# Altium project guitarDSP.PrjPcb
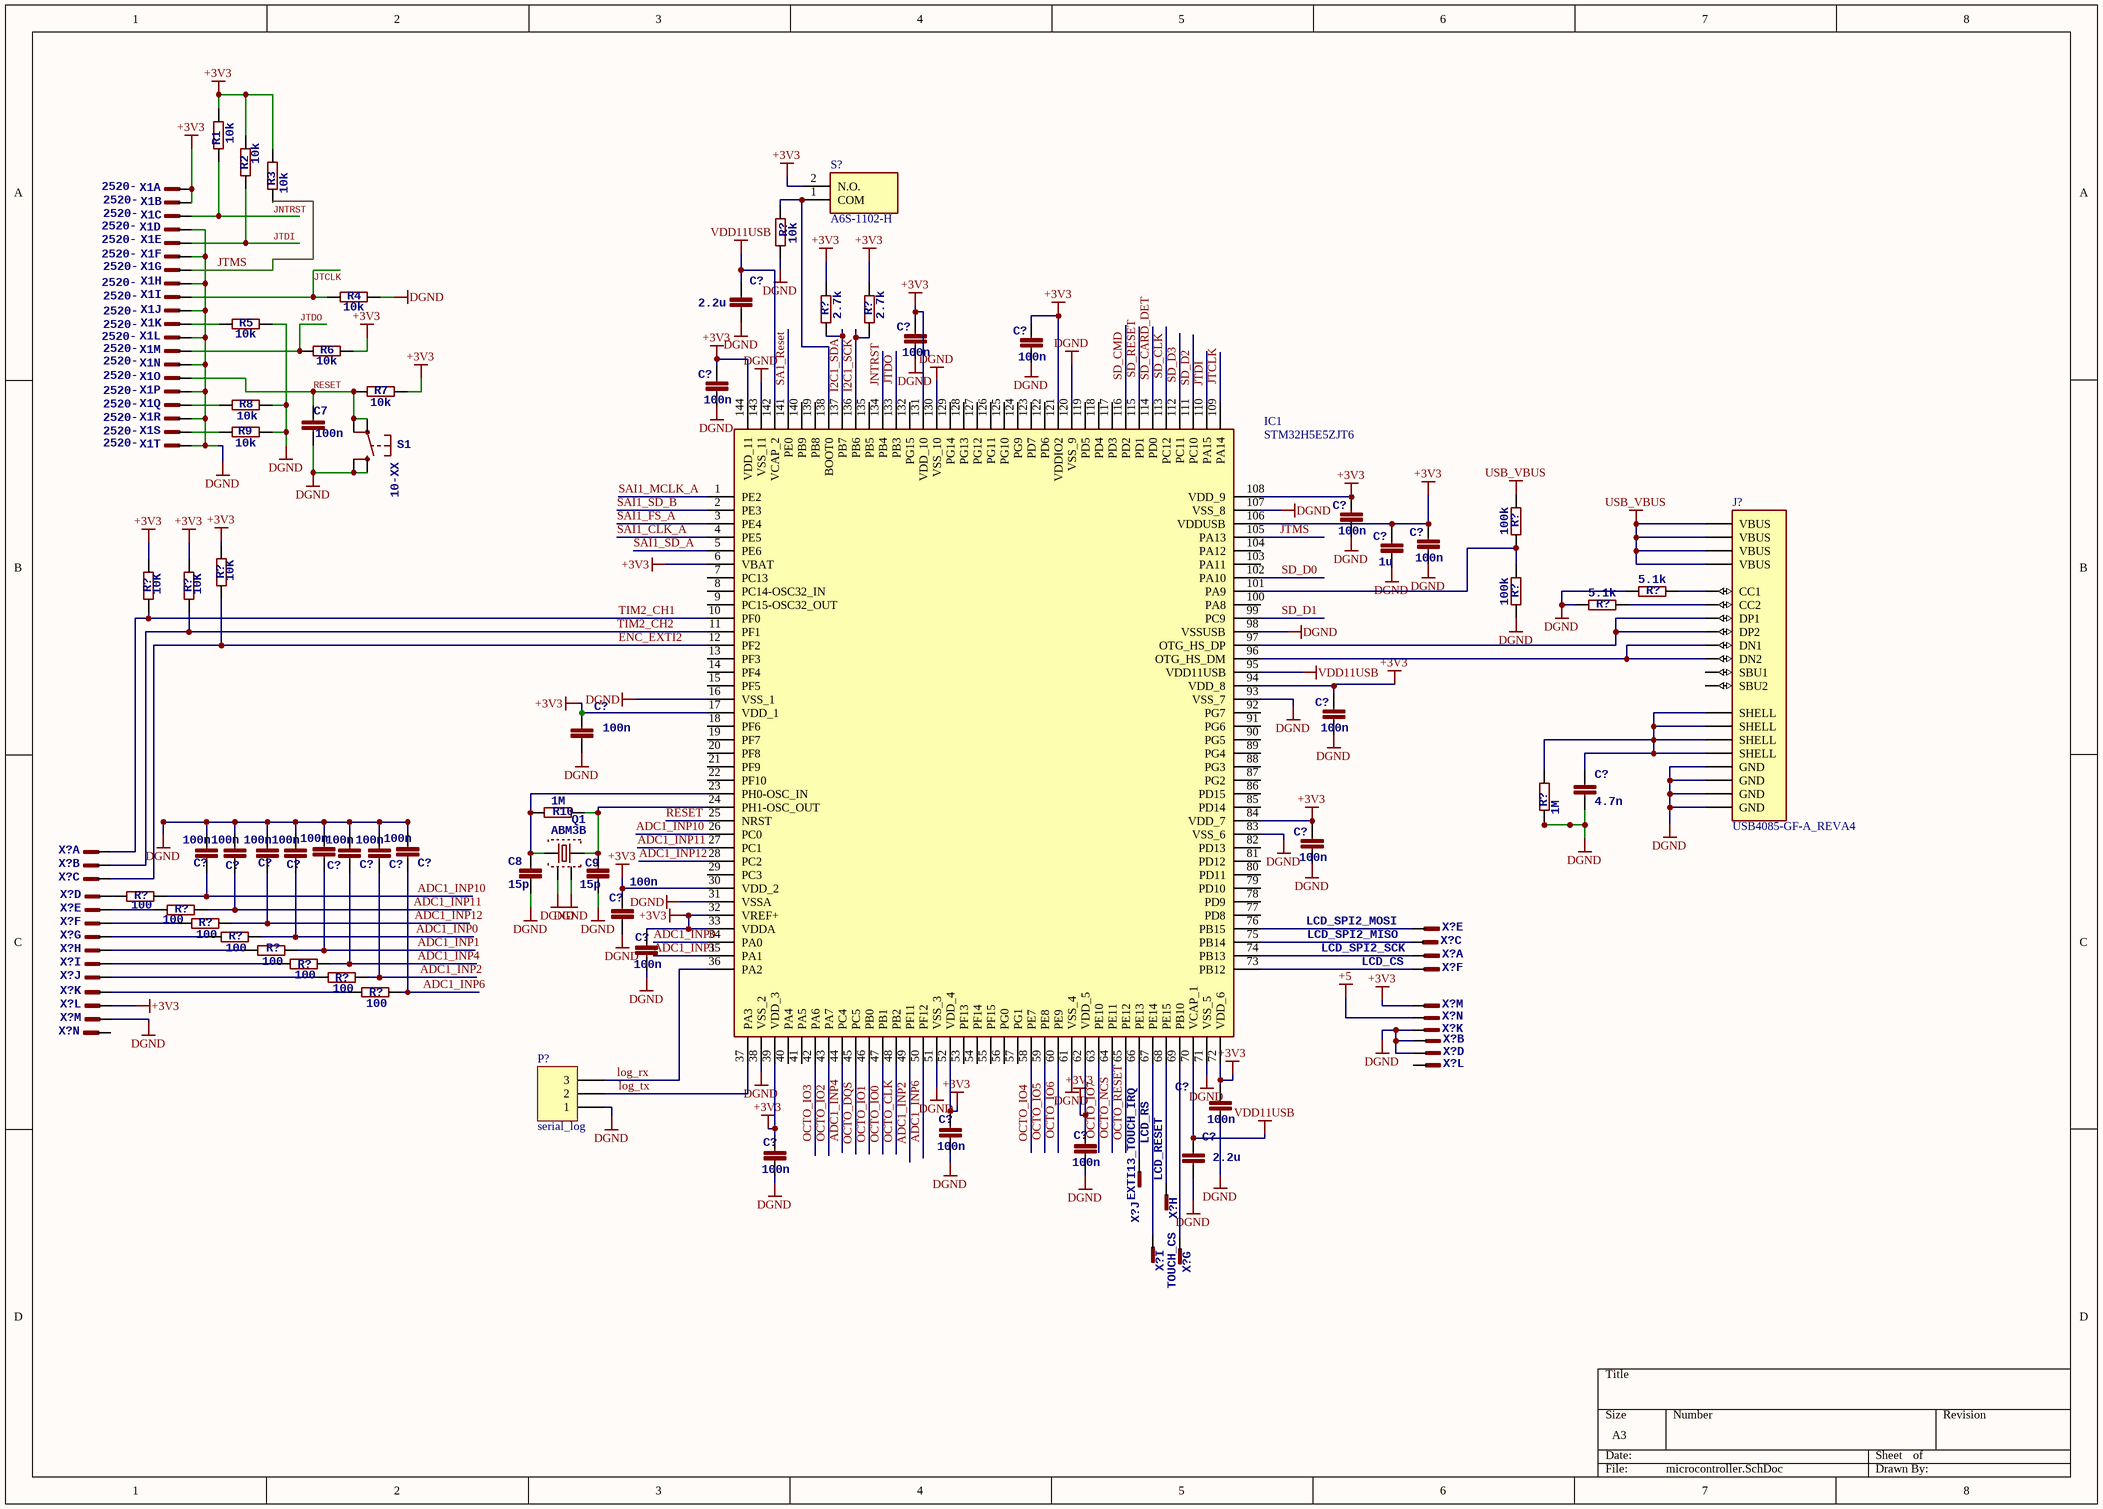
[diagram p0: microcontroller.SchDoc]
4 sheets, 138 parts. Net scope: global (net labels, ports and power ports of the same name join across sheets).
Board file: dsp.PcbDoc
Sheets:
  microcontroller.SchDoc
  memory.SchDoc
  audio.SchDoc
  bluetooth.SchDoc

## Sheet microcontroller.SchDoc
size A3; SheetNumber: 1; SheetTotal: 4

### Parts
(Parts that share a designator on the sheet are numbered #1, #2 ... from top to bottom, then left to right.)
C7  100n  [C0402]
C8  15p  [C0402]
C9  15p  [C0402]
C?#1  2.2u  [C0805]
C?#2  100n  [C0402]
C?#3  100n  [C0402]
C?#4  100n  [C0402]
C?#5  100n  [C0402]
C?#6  1u  [C0402]
C?#7  100n  [C0402]
C?#8  100n  [C0402]
C?#9  100n  [C0402]
C?#10  4.7n  [C0805]
C?#11  100n  [C0402]
C?#12  100n  [C0402]
C?#13  100n  [C0402]
C?#14  100n  [C0402]
C?#15  100n  [C0402]
C?#16  100n  [C0402]
C?#17  100n  [C0402]
C?#18  100n  [C0402]
C?#19  100n  [C0402]
C?#20  100n  [C0402]
C?#21  100n  [C0402]
C?#22  100n  [C0402]
C?#23  100n  [C0402]
C?#24  100n  [C0402]
C?#25  100n  [C0402]
C?#26  2.2u  [C0805]
IC1  STM32H5E5ZJT6  [QFP50P2200X2200X160-144N]
J?  USB4085-GF-A_REVA4  [GCT_USB4085-GF-A_REVA4]
P?#1  serial_log  [HDR1X3]
Q1  ABM3B  [ABM3B]
R1  10k  [R0805]
R2  10k  [R0805]
R3  10k  [R0805]
R4  10k  [R0805]
R5  10k  [R0805]
R6  10k  [R0805]
R7  10k  [R0805]
R8  10k  [R0805]
R9  10k  [R0805]
R10  1M  [R0402]
R?#1  10k  [R0805]
R?#2  2.7k  [R0805]
R?#3  2.7k  [R0805]
R?#4  100k  [R0805]
R?#5  10K  [R0805]
R?#6  10K  [R0805]
R?#7  10K  [R0805]
R?#8  100k  [R0805]
R?#9  5.1k  [R0805]
R?#10  5.1k  [R0805]
R?#11  1M  [R0805]
R?#12  100  [R0805]
R?#13  100  [R0805]
R?#14  100  [R0805]
R?#15  100  [R0805]
R?#16  100  [R0805]
R?#17  100  [R0805]
R?#18  100  [R0805]
R?#19  100  [R0805]
S1  10-XX  [B3F-10XX]
S?  A6S-1102-H  [A6S1102H]
X1  2520-  [PAK100/2500-20]  (parts A,B,C,D,E,F,G,H,I,J,K,L,M,N,O,P,Q,R,S,T of 20)
X?#1  (no value)  [PAK100/2500-14]  (part A of 14)
X?#2  (no value)  [PAK100/2500-14]  (part B of 14)
X?#3  (no value)  [PAK100/2500-14]  (part C of 14)
X?#4  (no value)  [PAK100/2500-14]  (part D of 14)
X?#5  (no value)  [PAK100/2500-14]  (part E of 14)
X?#6  (no value)  [PAK100/2500-14]  (part F of 14)
X?#7  LCD_SPI2_MOSI  [PAK100/2500-14]  (part E of 14)
X?#8  (no value)  [PAK100/2500-14]  (part G of 14)
X?#9  LCD_SPI2_MISO  [PAK100/2500-14]  (part C of 14)
X?#10  (no value)  [PAK100/2500-14]  (part H of 14)
X?#11  LCD_SPI2_SCK  [PAK100/2500-14]  (part A of 14)
X?#12  (no value)  [PAK100/2500-14]  (part I of 14)
X?#13  LCD_CS  [PAK100/2500-14]  (part F of 14)
X?#14  (no value)  [PAK100/2500-14]  (part J of 14)
X?#15  (no value)  [PAK100/2500-14]  (part K of 14)
X?#16  (no value)  [PAK100/2500-14]  (part L of 14)
X?#17  LCD_CS  [PAK100/2500-14]  (value not drawn)  (part M of 14)
X?#18  (no value)  [PAK100/2500-14]  (part M of 14)
X?#19  LCD_CS  [PAK100/2500-14]  (value not drawn)  (part N of 14)
X?#20  (no value)  [PAK100/2500-14]  (part N of 14)
X?#21  (no value)  [PAK100/2500-14]  (part K of 14)
X?#22  (no value)  [PAK100/2500-14]  (part B of 14)
X?#23  (no value)  [PAK100/2500-14]  (part D of 14)
X?#24  LCD_CS  [PAK100/2500-14]  (value not drawn)  (part L of 14)
X?#25  EXTI13_TOUCH_IRQ  [PAK100/2500-14]  (part J of 14)
X?#26  LCD_RESET  [PAK100/2500-14]  (part H of 14)
X?#27  LCD_RS  [PAK100/2500-14]  (part I of 14)
X?#28  TOUCH_CS  [PAK100/2500-14]  (part G of 14)

### Nets
+3V3: C?#2.1 C?#3.1 C?#4.1 C?#5.1 C?#6.1 C?#7.1 C?#8.1 C?#9.1 C?#11.1 C?#20.1 C?#21.1 C?#22.1 C?#23.1 C?#24.1 C?#25.1 IC1.6(VBAT) IC1.17(VDD_1) IC1.30(VDD_2) IC1.32(VREF+) IC1.33(VDDA) IC1.39(VDD_3) IC1.52(VDD_4) IC1.62(VDD_5) IC1.72(VDD_6) IC1.84(VDD_7) IC1.94(VDD_8) IC1.106(VDDUSB) IC1.108(VDD_9) IC1.121(VDDIO2) IC1.131(VDD_10) IC1.144(VDD_11) R1.2 R2.2 R3.2 R6.1 R7.1 R?#2.1 R?#3.1 R?#5.1 R?#6.1 R?#7.1 S?.2(N.O.) X1.1(KL) X1.2(KL) X?#16.12(KL) X?#17.13(KL)
+5: X?#19.14(KL)
DGND: C7.2 C8.2 C9.2 C?#1.2 C?#2.2 C?#3.2 C?#4.2 C?#5.2 C?#6.2 C?#7.2 C?#8.2 C?#9.2 C?#10.2 C?#11.2 C?#12.1 C?#13.1 C?#14.1 C?#15.1 C?#16.1 C?#17.1 C?#18.1 C?#19.1 C?#20.2 C?#21.2 C?#22.2 C?#23.2 C?#24.2 C?#25.2 C?#26.2 IC1.16(VSS_1) IC1.31(VSSA) IC1.38(VSS_2) IC1.51(VSS_3) IC1.61(VSS_4) IC1.71(VSS_5) IC1.83(VSS_6) IC1.93(VSS_7) IC1.98(VSSUSB) IC1.107(VSS_8) IC1.120(VSS_9) IC1.130(VSS_10) IC1.143(VSS_11) J?.A1(GND) J?.A12(GND) J?.B1(GND) J?.B12(GND) P?#1.1 Q1.P$2 Q1.P$4 R4.1 R5.1 R8.1 R9.1 R?#1.2 R?#8.2 R?#9.2 R?#10.2 R?#11.1 S1.1(S) S1.2(S1) X1.4(KL) X1.6(KL) X1.8(KL) X1.10(KL) X1.12(KL) X1.14(KL) X1.16(KL) X1.18(KL) X1.20(KL) X?#18.13(KL) X?#21.11(KL) X?#22.2(KL) X?#23.4(KL)
USB_VBUS: J?.A4(VBUS) J?.A9(VBUS) J?.B4(VBUS) J?.B9(VBUS) R?#4.1
VDD11USB: C?#1.1 C?#26.1 IC1.70(VCAP_1) IC1.95(VDD11USB) IC1.142(VCAP_2)
ADC1_INP0: C?#17.2 IC1.34(PA0) R?#15.1
ADC1_INP1: C?#12.2 IC1.35(PA1) R?#16.1
ADC1_INP2: C?#19.2 IC1.49(PF11) R?#18.1
ADC1_INP4: C?#18.2 IC1.44(PC4) R?#17.1
ADC1_INP6: C?#13.2 IC1.50(PF12) R?#19.1
ADC1_INP10: C?#14.2 IC1.26(PC0) R?#12.1
ADC1_INP11: C?#15.2 IC1.27(PC1) R?#13.1
ADC1_INP12: C?#16.2 IC1.28(PC2) R?#14.1
ENC_EXTI2: IC1.12(PF2) R?#5.2 X?#3.3(KL)
I2C1_SCK: IC1.136(PB6) R?#3.2
I2C1_SDA: IC1.137(PB7) R?#2.2
JNTRST: IC1.134(PB4) R1.1 X1.3(KL)
JTCLK: IC1.109(PA14) R4.2 X1.9(KL)
JTDI: IC1.110(PA15) R2.1 X1.5(KL)
JTDO: IC1.133(PB3) R6.2 X1.13(KL)
JTMS: IC1.105(PA13) R3.1 X1.7(KL)
log_rx: IC1.36(PA2) P?#1.3
log_tx: IC1.37(PA3) P?#1.2
OCTO_CLK: IC1.48(PB2)
OCTO_DQS: IC1.45(PC5)
OCTO_IO0: IC1.47(PB1)
OCTO_IO1: IC1.46(PB0)
OCTO_IO2: IC1.43(PA7)
OCTO_IO3: IC1.42(PA6)
OCTO_IO4: IC1.58(PE7)
OCTO_IO5: IC1.59(PE8)
OCTO_IO6: IC1.60(PE9)
OCTO_IO7: IC1.63(PE10)
OCTO_NCS: IC1.64(PE11)
OCTO_RESET: IC1.65(PE12)
RESET: C7.1 IC1.25(NRST) R7.2 S1.3(P) S1.4(P1) X1.15(KL)
SA1_Reset: IC1.141(PE0)
SAI1_CLK_A: IC1.4(PE5)
SAI1_FS_A: IC1.3(PE4)
SAI1_MCLK_A: IC1.1(PE2)
SAI1_SD_A: IC1.5(PE6)
SAI1_SD_B: IC1.2(PE3)
SD_CARD_DET: IC1.114(PD0)
SD_CLK: IC1.113(PC12)
SD_CMD: IC1.116(PD2)
SD_D0: IC1.102(PA10)
SD_D1: IC1.99(PC9)
SD_D2: IC1.111(PC10)
SD_D3: IC1.112(PC11)
SD_RESET: IC1.115(PD1)
TIM2_CH1: IC1.10(PF0) R?#6.2 X?#1.1(KL)
TIM2_CH2: IC1.11(PF1) R?#7.2 X?#2.2(KL)
NetC8_1: C8.1 IC1.23(PH0-OSC_IN) Q1.P$1 R10.2
NetC9_1: C9.1 IC1.24(PH1-OSC_OUT) Q1.P$3 R10.1
NetC?#10_1: C?#10.1 J?.S1(SHELL) J?.S2(SHELL) J?.S3(SHELL) J?.S4(SHELL) R?#11.2
NetIC1_66: IC1.66(PE13) X?#25.10(KL)
NetIC1_67: IC1.67(PE14) X?#27.9(KL)
NetIC1_68: IC1.68(PE15) X?#26.8(KL)
NetIC1_69: IC1.69(PB10) X?#28.7(KL)
NetIC1_73: IC1.73(PB12) X?#13.6(KL)
NetIC1_74: IC1.74(PB13) X?#11.1(KL)
NetIC1_75: IC1.75(PB14) X?#9.3(KL)
NetIC1_76: IC1.76(PB15) X?#7.5(KL)
NetIC1_96: IC1.96(OTG_HS_DM) J?.A7(DN1) J?.B7(DN2)
NetIC1_97: IC1.97(OTG_HS_DP) J?.A6(DP1) J?.B6(DP2)
NetIC1_101: IC1.101(PA9) R?#4.2 R?#8.1
NetIC1_138: IC1.138(BOOT0) R?#1.1 S?.1(COM)
NetJ?_A5: J?.A5(CC1) R?#9.1
NetJ?_B5: J?.B5(CC2) R?#10.1
NetR5_2: R5.2 X1.11(KL)
NetR8_2: R8.2 X1.17(KL)
NetR9_2: R9.2 X1.19(KL)
NetR?#12_2: R?#12.2 X?#4.4(KL)
NetR?#13_2: R?#13.2 X?#5.5(KL)
NetR?#14_2: R?#14.2 X?#6.6(KL)
NetR?#15_2: R?#15.2 X?#8.7(KL)
NetR?#16_2: R?#16.2 X?#10.8(KL)
NetR?#17_2: R?#17.2 X?#12.9(KL)
NetR?#18_2: R?#18.2 X?#14.10(KL)
NetR?#19_2: R?#19.2 X?#15.11(KL)

Not connected (* = marked no-connect by the designer): IC1 7(PC13) 8(PC14-OSC32_IN) 9(PC15-OSC32_OUT) 13(PF3) 14(PF4) 15(PF5) 18(PF6) 19(PF7) 20(PF8) 21(PF9) 22(PF10) 29(PC3) 40(PA4) 41(PA5) 53(PF13) 54(PF14) 55(PF15) 56(PG0) 57(PG1) 77(PD8) 78(PD9) 79(PD10) 80(PD11) 81(PD12) 82(PD13) 85(PD14) 86(PD15) 87(PG2) 88(PG3) 89(PG4) 90(PG5) 91(PG6) 92(PG7) 100(PA8) 103(PA11) 104(PA12) 117(PD3) 118(PD4) 119(PD5) 122(PD6) 123(PD7) 124(PG9) 125(PG10) 126(PG11) 127(PG12) 128(PG13) 129(PG14) 132(PG15) 135(PB5) 139(PB8) 140(PB9); J? A8(SBU1) B8(SBU2); X?#20 14(KL); X?#24 12(KL)

### Library data of the parts
C7-C9 C?#1-C?#9 C?#11-C?#26 = C-EUC0402: <B>CAPACITOR</B>, European symbol; SPICEPREFIX: C
C?#10 = C-EUC0805: <B>CAPACITOR</B>, European symbol; SPICEPREFIX: C
IC1 = STM32H5E5ZJT6: Integrated Circuit; Manufacturer_Name: STMicroelectronics; Datasheet Link: https://www.st.com/resource/en/datasheet/stm32h5e4vj.pdf; Height: 1.6mm; Manufacturer_Part_Number: STM32H5E5ZJT6; Arrow Part Number: STM32H5E5ZJT6; Arrow Price/Stock: https://www.arrow.com/en/products/stm32h5e5zjt6/stmicroelectronics.html?utm_currency=USD&region=nac
J? = USB4085-GF-A_REVA4: USB-C (USB TYPE-C) USB 2.0 Receptacle Connector 24 (16+8 Dummy) Position Through Hole, Right Angle, low cost, 3.46mm profile, 16 pin, horizontal, Top mount; MF: Global Connector Technology; SnapEDA_Link: https://www.snapeda.com/parts/USB4085-GF-A/Global+Connector+Technology/view-part/?ref=snap; Package: None; MP: USB4085-GF-A; Check_prices: https://www.snapeda.com/parts/USB4085-GF-A/Global+Connector+Technology/view-part/?ref=eda; Purchase-URL: https://pricing.snapeda.com/search/part/USB4085-GF-A/?ref=eda; Price: None; Value: *; Availability: In Stock
P?#1 = Header 3: Header, 3-Pin; LatestRevisionDate: 17-Jul-2002; LatestRevisionNote: Re-released for DXP Platform.; Publisher: Altium Limited
R1-R9 R?#1-R?#19 = R-EU_R0805: <B>RESISTOR</B>, European symbol
R10 = R-EU_R0402: <B>RESISTOR</B>, European symbol
S1 = 10-XX: <b>OMRON SWITCH</b>; MPN: B3F-1000; OC_FARNELL: 176432; OC_NEWARK: 36M3542
S? = A6S-1102-H: Switch; Manufacturer_Name: OMRON Electronics; Datasheet Link: https://components.omron.com/us-en/sites/components.omron.com.us/files/datasheet_pdf/A211-E1.pdf; Height: 3.8mm; Manufacturer_Part_Number: A6S-1102-H; Mouser Part Number: 653-A6S-1102-H; Mouser Price/Stock: https://www.mouser.co.uk/ProductDetail/Omron-Electronics/A6S-1102-H?qs=FFtkVBg2Ai6emF35RthuRw%3D%3D; Arrow Part Number: A6S-1102-H; Arrow Price/Stock: https://www.arrow.com/en/products/a6s1102h/omron?region=nac
X1 = 2520-: <b>3M (TM) Pak 100 4-Wall Header</b><p> / Source: 3M; OC_FARNELL: unknown; OC_NEWARK: unknown
X?#1-X?#28 = 2514-: OC_FARNELL: unknown; OC_NEWARK: unknown

## Sheet memory.SchDoc
size A4; SheetNumber: 2; SheetTotal: 4
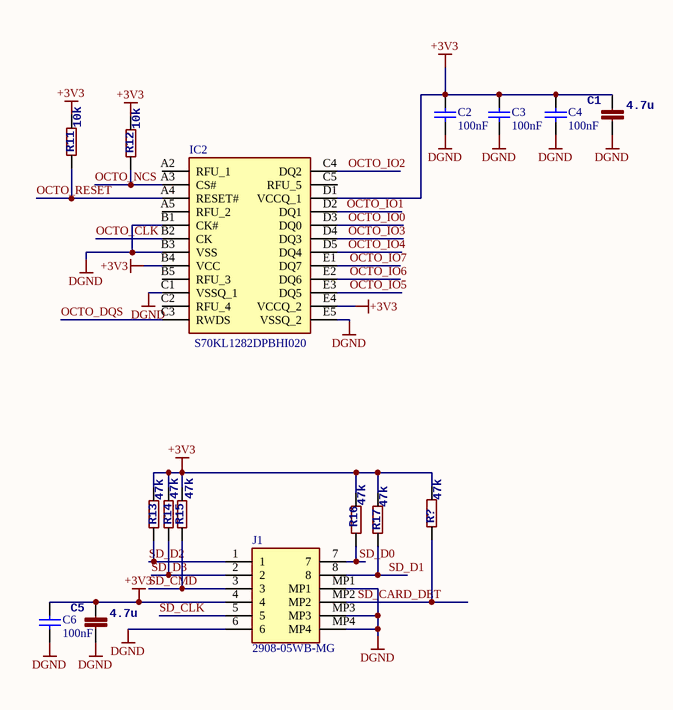
[diagram p1: memory.SchDoc]

### Parts
(Parts that share a designator on the sheet are numbered #1, #2 ... from top to bottom, then left to right.)
C1  4.7u  [C0805]
C2  value 100nF  [C0402]  (hidden comment: Capacitor)
C3  value 100nF  [C0402]  (hidden comment: Capacitor)
C4  value 100nF  [C0402]  (hidden comment: Capacitor)
C5  4.7u  [C0805]
C6  value 100nF  [C0402]  (hidden comment: Capacitor)
IC2  S70KL1282DPBHI020  [BGA24C100P5X5_600X800X100]
J1  2908-05WB-MG  [290805WBMG]
R11  10k  [R0805]
R12  10k  [R0805]
R13  47k  [R0805]
R14  47k  [R0805]
R15  47k  [R0805]
R16  47k  [R0805]
R17  47k  [R0805]
R?#20  47k  [R0805]

### Nets
+3V3: C1.1 C2.2 C3.2 C4.2 C5.1 C6.2 IC2.B4(VCC) IC2.D1(VCCQ_1) IC2.E4(VCCQ_2) J1.4 R11.2 R12.2 R13.2 R14.2 R15.2 R16.2 R17.2 R?#20.2
DGND: C1.2 C2.1 C3.1 C4.1 C5.2 C6.1 IC2.B1(CK#) IC2.B3(VSS) IC2.C1(VSSQ_1) IC2.E5(VSSQ_2) J1.6 J1.MP1 J1.MP3 J1.MP4
OCTO_CLK: IC2.B2(CK)
OCTO_DQS: IC2.C3(RWDS)
OCTO_IO0: IC2.D3(DQ0)
OCTO_IO1: IC2.D2(DQ1)
OCTO_IO2: IC2.C4(DQ2)
OCTO_IO3: IC2.D4(DQ3)
OCTO_IO4: IC2.D5(DQ4)
OCTO_IO5: IC2.E3(DQ5)
OCTO_IO6: IC2.E2(DQ6)
OCTO_IO7: IC2.E1(DQ7)
OCTO_NCS: IC2.A3(CS#) R12.1
OCTO_RESET: IC2.A4(RESET#) R11.1
SD_CARD_DET: J1.MP2 R?#20.1
SD_CLK: J1.5
SD_CMD: J1.3 R15.1
SD_D0: J1.7 R16.1
SD_D1: J1.8 R17.1
SD_D2: J1.1 R13.1
SD_D3: J1.2 R14.1

Not connected (* = marked no-connect by the designer): IC2 A2(RFU_1) A5(RFU_2) B5(RFU_3) C2(RFU_4) C5(RFU_5)

### Library data of the parts
C1 C5 = C-EUC0805: SPICEPREFIX: C
C2-C4 C6 = MCD-00102: Capacitor, MLCC, 100nF, 16V, X7R, 10%, 0402, T=0,5mm; Manufacturer_Part_Number: CC0402KRX7R7BB104; Manufacturer: YAGEO; Alternate_Manufacturer_Part_Number: GCM155R71C104KA55D; Alternate_Manufacturer: MURATA; ECCN_US: EAR99; ECCN_EU: NEC; Provided_By: SUBCO; Internal_Part_Number: MCD-00102; Status: Released; Part_Type: Capacitor; Package: C0402; ComponentLink1Description: Datasheet; ComponentLink1URL: http://tunmcdsvn.tun.st.com/Component_Datasheet_Library/Trunk/Capacitors/Yageo_Multilayer_Capacitor_X7R_series_100pF_to_22uF
IC2 = S70KL1282DPBHI020: Integrated Circuit; Manufacturer_Name: Infineon; Datasheet Link: https://www.cypress.com/file/501841/download; Height: 1mm; Manufacturer_Part_Number: S70KL1282DPBHI020; Mouser Part Number: 727-70KL1282DPBHI020; Mouser Price/Stock: https://www.mouser.co.uk/ProductDetail/Infineon-Technologies/S70KL1282DPBHI020?qs=DPoM0jnrROVgAEZ0o2TpIw%3D%3D
J1 = 2908-05WB-MG: Connector; Manufacturer_Name: 3M; Datasheet Link: https://componentsearchengine.com/Datasheets/1/2908-05WB-MG.pdf; Height: 1.85mm; Manufacturer_Part_Number: 2908-05WB-MG; Mouser Part Number: 517-2908-05WB-MG; Mouser Price/Stock: https://www.mouser.co.uk/ProductDetail/3M-Electronic-Solutions-Division/2908-05WB-MG?qs=vnwGVgFuQiZPJoOt79ALlw%3D%3D; Arrow Part Number: 2908-05WB-MG; Arrow Price/Stock: https://www.arrow.com/en/products/2908-05wb-mg/3m.html?utm_currency=USD&region=europe
R11-R17 R?#20 = R-EU_R0805: <B>RESISTOR</B>, European symbol

## Sheet audio.SchDoc
size A4; SheetNumber: 3; SheetTotal: 4
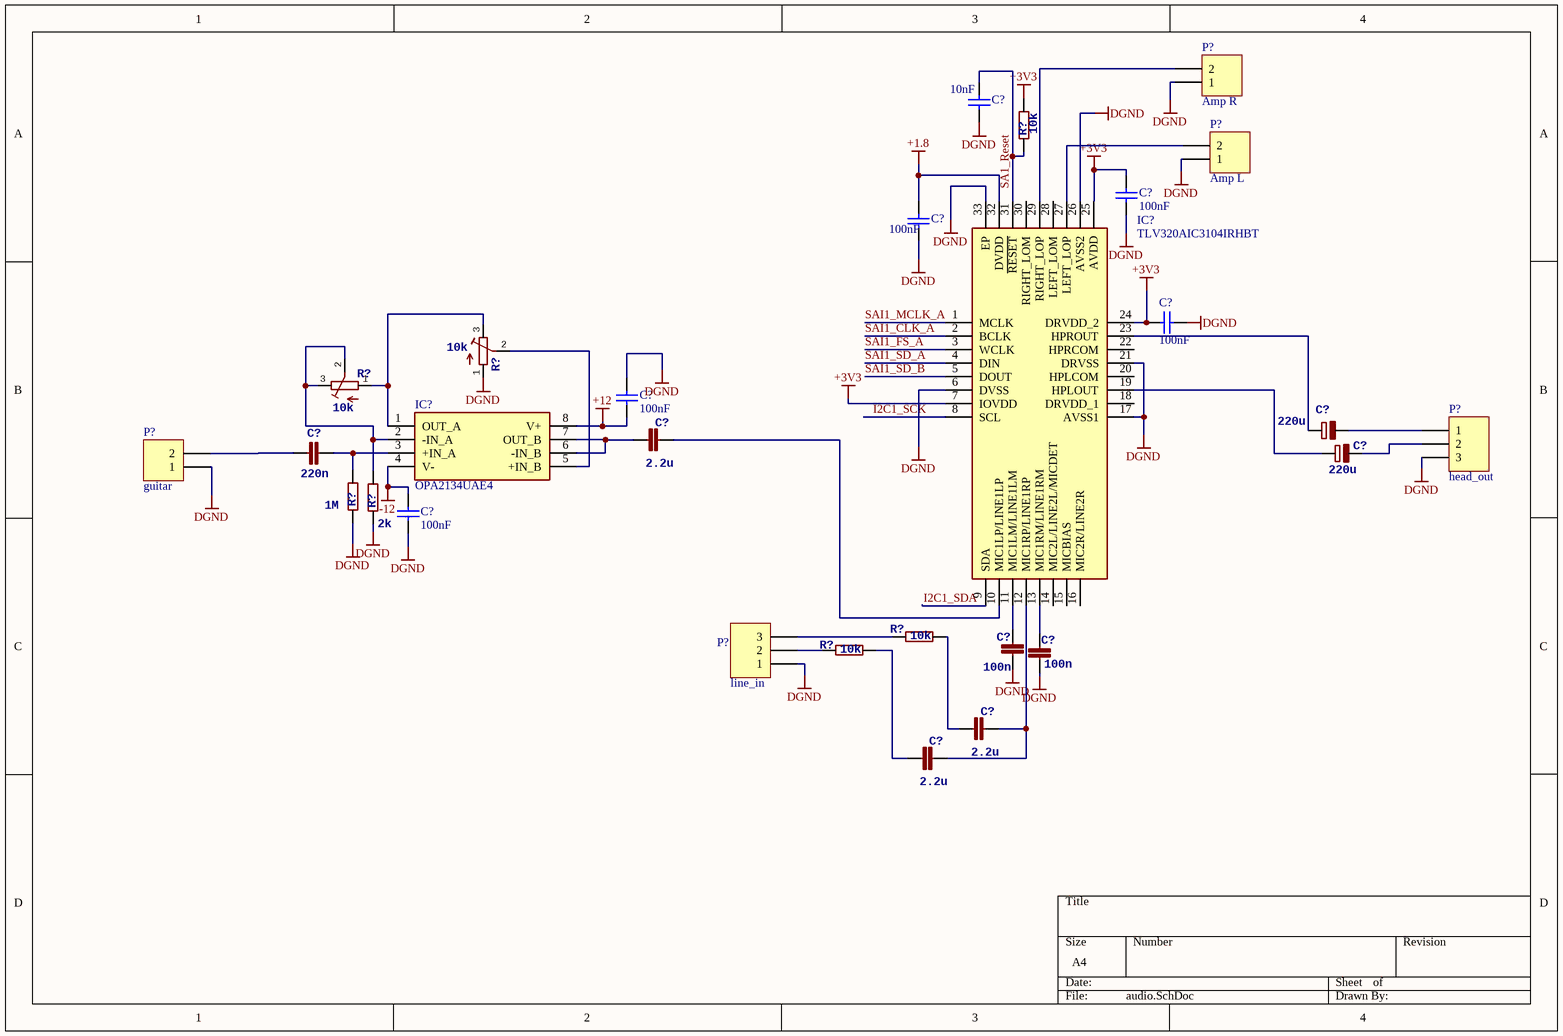
[diagram p2: audio.SchDoc]

### Parts
(Parts that share a designator on the sheet are numbered #1, #2 ... from top to bottom, then left to right.)
C?#27  value 10nF  [C0402]  (hidden comment: Capacitor)
C?#28  value 100nF  [C0402]  (hidden comment: Capacitor)
C?#29  value 100nF  [C0402]  (hidden comment: Capacitor)
C?#30  value 100nF  [C0402]  (hidden comment: Capacitor)
C?#31  value 100nF  [C0402]  (hidden comment: Capacitor)
C?#32  220u  [E2,5-7]
C?#33  2.2u  [C0805]
C?#34  220n  [C2220K]
C?#35  220u  [E2,5-7]
C?#36  value 100nF  [C0402]  (hidden comment: Capacitor)
C?#37  100n  [C2220K]
C?#38  100n  [C2220K]
C?#39  2.2u  [C0805]
C?#40  2.2u  [C0805]
IC?#1  TLV320AIC3104IRHBT  [QFN50P500X500X100-33N-D]
IC?#2  OPA2134UAE4  [SOIC127P600X175-8N]
P?#2  Amp R  [HDR1X2]
P?#3  Amp L  [HDR1X2]
P?#4  head_out  [HDR1X3]
P?#5  guitar  [HDR1X2]
P?#6  line_in  [HDR1X3]
R?#21  10k  [R0805]
R?#22  10k  [RTRIM64Y]
R?#23  10k  [RTRIM64Y]
R?#24  1M  [R0805]
R?#25  2k  [R0805]
R?#26  10k  [R0805]
R?#27  10k  [R0805]

### Nets
+1.8: C?#29.2 IC?#1.32(DVDD)
+3V3: C?#28.2 C?#30.2 IC?#1.7(IOVDD) IC?#1.24(DRVDD_2) IC?#1.25(AVDD) R?#21.2
+12: C?#31.2 IC?#2.8(V+)
-12: C?#36.1 IC?#2.4(V-)
DGND: C?#27.1 C?#28.1 C?#29.1 C?#30.1 C?#31.1 C?#36.2 C?#37.1 C?#38.1 IC?#1.6(DVSS) IC?#1.17(AVSS1) IC?#1.21(DRVSS) IC?#1.26(AVSS2) IC?#1.33(EP) P?#2.1 P?#3.1 P?#4.3 P?#5.1 P?#6.1 R?#22.1(A) R?#24.1 R?#25.1
I2C1_SCK: IC?#1.8(SCL)
I2C1_SDA: IC?#1.9(SDA)
SA1_Reset: C?#27.2 IC?#1.31(~{RESET}) R?#21.1
SAI1_CLK_A: IC?#1.2(BCLK)
SAI1_FS_A: IC?#1.3(WCLK)
SAI1_MCLK_A: IC?#1.1(MCLK)
SAI1_SD_A: IC?#1.4(DIN)
SAI1_SD_B: IC?#1.5(DOUT)
NetC?#32_+: C?#32.+ IC?#1.23(HPROUT)
NetC?#32_-: C?#32.- P?#4.1
NetC?#33_1: C?#33.1 IC?#2.6(-IN_B) IC?#2.7(OUT_B)
NetC?#33_2: C?#33.2 IC?#1.10(MIC1LP/LINE1LP)
NetC?#34_1: C?#34.1 P?#5.2
NetC?#34_2: C?#34.2 IC?#2.3(+IN_A) R?#24.2
NetC?#35_+: C?#35.+ IC?#1.19(HPLOUT)
NetC?#35_-: C?#35.- P?#4.2
NetC?#37_2: C?#37.2 IC?#1.11(MIC1LM/LINE1LM)
NetC?#38_2: C?#38.2 IC?#1.13(MIC1RM/LINE1RM)
NetC?#39_1: C?#39.1 R?#26.1
NetC?#39_2: C?#39.2 C?#40.2 IC?#1.12(MIC1RP/LINE1RP)
NetC?#40_1: C?#40.1 R?#27.1
NetIC?#1_27: IC?#1.27(LEFT_LOP) P?#3.2
NetIC?#1_29: IC?#1.29(RIGHT_LOP) P?#2.2
NetIC?#2_1: IC?#2.1(OUT_A) R?#22.3(E) R?#23.1(A)
NetIC?#2_2: IC?#2.2(-IN_A) R?#23.2(S) R?#23.3(E) R?#25.2
NetIC?#2_5: IC?#2.5(+IN_B) R?#22.2(S)
NetP?#6_2: P?#6.2 R?#27.2
NetP?#6_3: P?#6.3 R?#26.2

Not connected (* = marked no-connect by the designer): IC?#1 14(MIC2L/LINE2L/MICDET) 15(MICBIAS) 16(MIC2R/LINE2R) 18(DRVDD_1) 20(HPLCOM) 22(HPRCOM) 28(LEFT_LOM) 30(RIGHT_LOM)

### Library data of the parts
C?#27-C?#31 C?#36 = MCD-00102: as C2 on sheet memory; Internal_Part_Number: MCD-00102; Status: Released; Part_Type: Capacitor; Package: C0402; ComponentLink1Description: Datasheet; ComponentLink1URL: http://tunmcdsvn.tun.st.com/Component_Datasheet_Library/Trunk/Capacitors/Yageo_Multilayer_Capacitor_X7R_series_100pF_to_22uF
C?#32 C?#35 = CPOL-EUE2.5-7: SPICEPREFIX: C
C?#33 C?#39 C?#40 = C-EUC0402: <B>CAPACITOR</B>, European symbol; SPICEPREFIX: C
C?#34 = C-EUC2220K: C1812C224J5GACTU Multilayer Ceramic Capacitors MLCC - SMD/SMT 50V 0.22uF C0G 1812 5%; SPICEPREFIX: C
C?#37 C?#38 = C-EUC2220K: C4532C0G2A104J320KA Multilayer Ceramic Capacitors MLCC - SMD/SMT 1812 100V 0.1uF C0G 5% T: 3.2mm; SPICEPREFIX: C
IC?#1 = TLV320AIC3104IRHBT: Integrated Circuit; Manufacturer_Name: Texas Instruments; Datasheet Link: http://www.ti.com/lit/gpn/tlv320aic3104; Height: 1mm; Manufacturer_Part_Number: TLV320AIC3104IRHBT; Mouser Part Number: 595-TLV320C3104IRHBT; Mouser Price/Stock: https://www.mouser.co.uk/ProductDetail/Texas-Instruments/TLV320AIC3104IRHBT?qs=t6sYTo5dwUz0wA7yRaTR5Q%3D%3D; Arrow Part Number: TLV320AIC3104IRHBT; Arrow Price/Stock: https://www.arrow.com/en/products/tlv320aic3104irhbt/texas-instruments.html?utm_currency=USD&region=nac
IC?#2 = OPA2134UAE4: Integrated Circuit; Manufacturer_Name: Texas Instruments; Datasheet Link: https://www.ti.com/lit/gpn/OPA2134; Height: 1.75mm; Manufacturer_Part_Number: OPA2134UAE4; Mouser Part Number: 595-OPA2134UAE4; Mouser Price/Stock: https://www.mouser.co.uk/ProductDetail/Texas-Instruments/OPA2134UAE4?qs=7nS3%252BbEUL6uzphh9X3AzMA%3D%3D
P?#2 P?#3 P?#5 = Header 2: Header, 2-Pin; LatestRevisionDate: 17-Jul-2002; LatestRevisionNote: Re-released for DXP Platform.; Publisher: Altium Limited
P?#4 P?#6 = Header 3: Header, 3-Pin; LatestRevisionDate: 17-Jul-2002; LatestRevisionNote: Re-released for DXP Platform.; Publisher: Altium Limited
R?#21 R?#24-R?#27 = R-EU_R0805: <B>RESISTOR</B>, European symbol
R?#22 R?#23 = R-TRIMM64Y: SPICEMODEL: X; SPICEPREFIXL: POT

## Sheet bluetooth.SchDoc
size A4; SheetNumber: 4; SheetTotal: 4
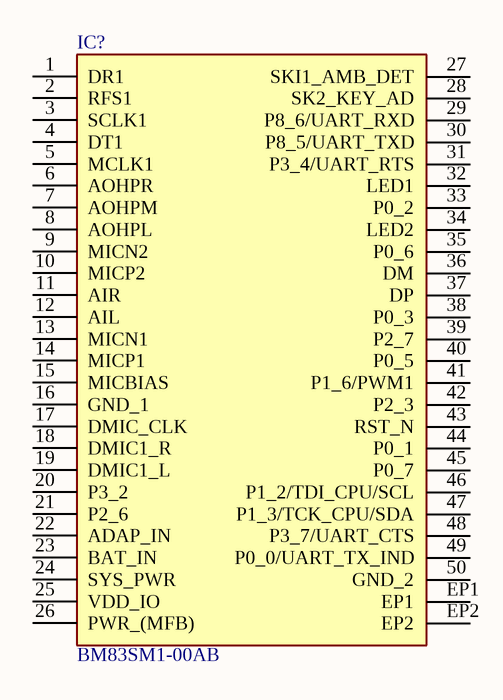
[diagram p3: bluetooth.SchDoc]

### Parts
(Parts that share a designator on the sheet are numbered #1, #2 ... from top to bottom, then left to right.)
IC?#3  BM83SM1-00AB  [BM83SM100AA]

### Nets

Not connected (* = marked no-connect by the designer): IC?#3 1(DR1) 2(RFS1) 3(SCLK1) 4(DT1) 5(MCLK1) 6(AOHPR) 7(AOHPM) 8(AOHPL) 9(MICN2) 10(MICP2) 11(AIR) 12(AIL) 13(MICN1) 14(MICP1) 15(MICBIAS) 16(GND_1) 17(DMIC_CLK) 18(DMIC1_R) 19(DMIC1_L) 20(P3_2) 21(P2_6) 22(ADAP_IN) 23(BAT_IN) 24(SYS_PWR) 25(VDD_IO) 26(PWR_(MFB)) 27(SKI1_AMB_DET) 28(SK2_KEY_AD) 29(P8_6/UART_RXD) 30(P8_5/UART_TXD) 31(P3_4/UART_RTS) 32(LED1) 33(P0_2) 34(LED2) 35(P0_6) 36(DM) 37(DP) 38(P0_3) 39(P2_7) 40(P0_5) 41(P1_6/PWM1) 42(P2_3) 43(RST_N) 44(P0_1) 45(P0_7) 46(P1_2/TDI_CPU/SCL) 47(P1_3/TCK_CPU/SDA) 48(P3_7/UART_CTS) 49(P0_0/UART_TX_IND) 50(GND_2) EP1 EP2

### Library data of the parts
IC?#3 = BM83SM1-00AB: Integrated Circuit; Manufacturer_Name: Microchip; Datasheet Link: http://ww1.microchip.com/downloads/en/DeviceDoc/BM83_Bluetooth_Stereo_Audio_Module_Data_Sheet_DS70005402A.pdf; Height: 2.5mm; Manufacturer_Part_Number: BM83SM1-00AB; Mouser Part Number: 579-BM83SM1-00AB; Mouser Price/Stock: https://www.mouser.co.uk/ProductDetail/Microchip-Technology/BM83SM1-00AB?qs=W%2FMpXkg%252BdQ4%2FPurIjXhtZA%3D%3D; Arrow Part Number: BM83SM1-00AB; Arrow Price/Stock: https://www.arrow.com/en/products/bm83sm1-00ab/microchip-technology.html?utm_currency=USD&region=nac

## Nets that join several sheets
+3V3: microcontroller (46 pins), memory (18 pins), audio (6 pins)
DGND: microcontroller (73 pins), memory (14 pins), audio (21 pins)
I2C1_SCK: microcontroller (IC1.136 R?#3.2), audio (IC?#1.8)
I2C1_SDA: microcontroller (IC1.137 R?#2.2), audio (IC?#1.9)
OCTO_CLK: microcontroller (IC1.48), memory (IC2.B2)
OCTO_DQS: microcontroller (IC1.45), memory (IC2.C3)
OCTO_IO0: microcontroller (IC1.47), memory (IC2.D3)
OCTO_IO1: microcontroller (IC1.46), memory (IC2.D2)
OCTO_IO2: microcontroller (IC1.43), memory (IC2.C4)
OCTO_IO3: microcontroller (IC1.42), memory (IC2.D4)
OCTO_IO4: microcontroller (IC1.58), memory (IC2.D5)
OCTO_IO5: microcontroller (IC1.59), memory (IC2.E3)
OCTO_IO6: microcontroller (IC1.60), memory (IC2.E2)
OCTO_IO7: microcontroller (IC1.63), memory (IC2.E1)
OCTO_NCS: microcontroller (IC1.64), memory (IC2.A3 R12.1)
OCTO_RESET: microcontroller (IC1.65), memory (IC2.A4 R11.1)
SA1_Reset: microcontroller (IC1.141), audio (C?#27.2 IC?#1.31 R?#21.1)
SAI1_CLK_A: microcontroller (IC1.4), audio (IC?#1.2)
SAI1_FS_A: microcontroller (IC1.3), audio (IC?#1.3)
SAI1_MCLK_A: microcontroller (IC1.1), audio (IC?#1.1)
SAI1_SD_A: microcontroller (IC1.5), audio (IC?#1.4)
SAI1_SD_B: microcontroller (IC1.2), audio (IC?#1.5)
SD_CARD_DET: microcontroller (IC1.114), memory (J1.MP2 R?#20.1)
SD_CLK: microcontroller (IC1.113), memory (J1.5)
SD_CMD: microcontroller (IC1.116), memory (J1.3 R15.1)
SD_D0: microcontroller (IC1.102), memory (J1.7 R16.1)
SD_D1: microcontroller (IC1.99), memory (J1.8 R17.1)
SD_D2: microcontroller (IC1.111), memory (J1.1 R13.1)
SD_D3: microcontroller (IC1.112), memory (J1.2 R14.1)